# Altium schematic sheet Outputs.SchDoc
size A2
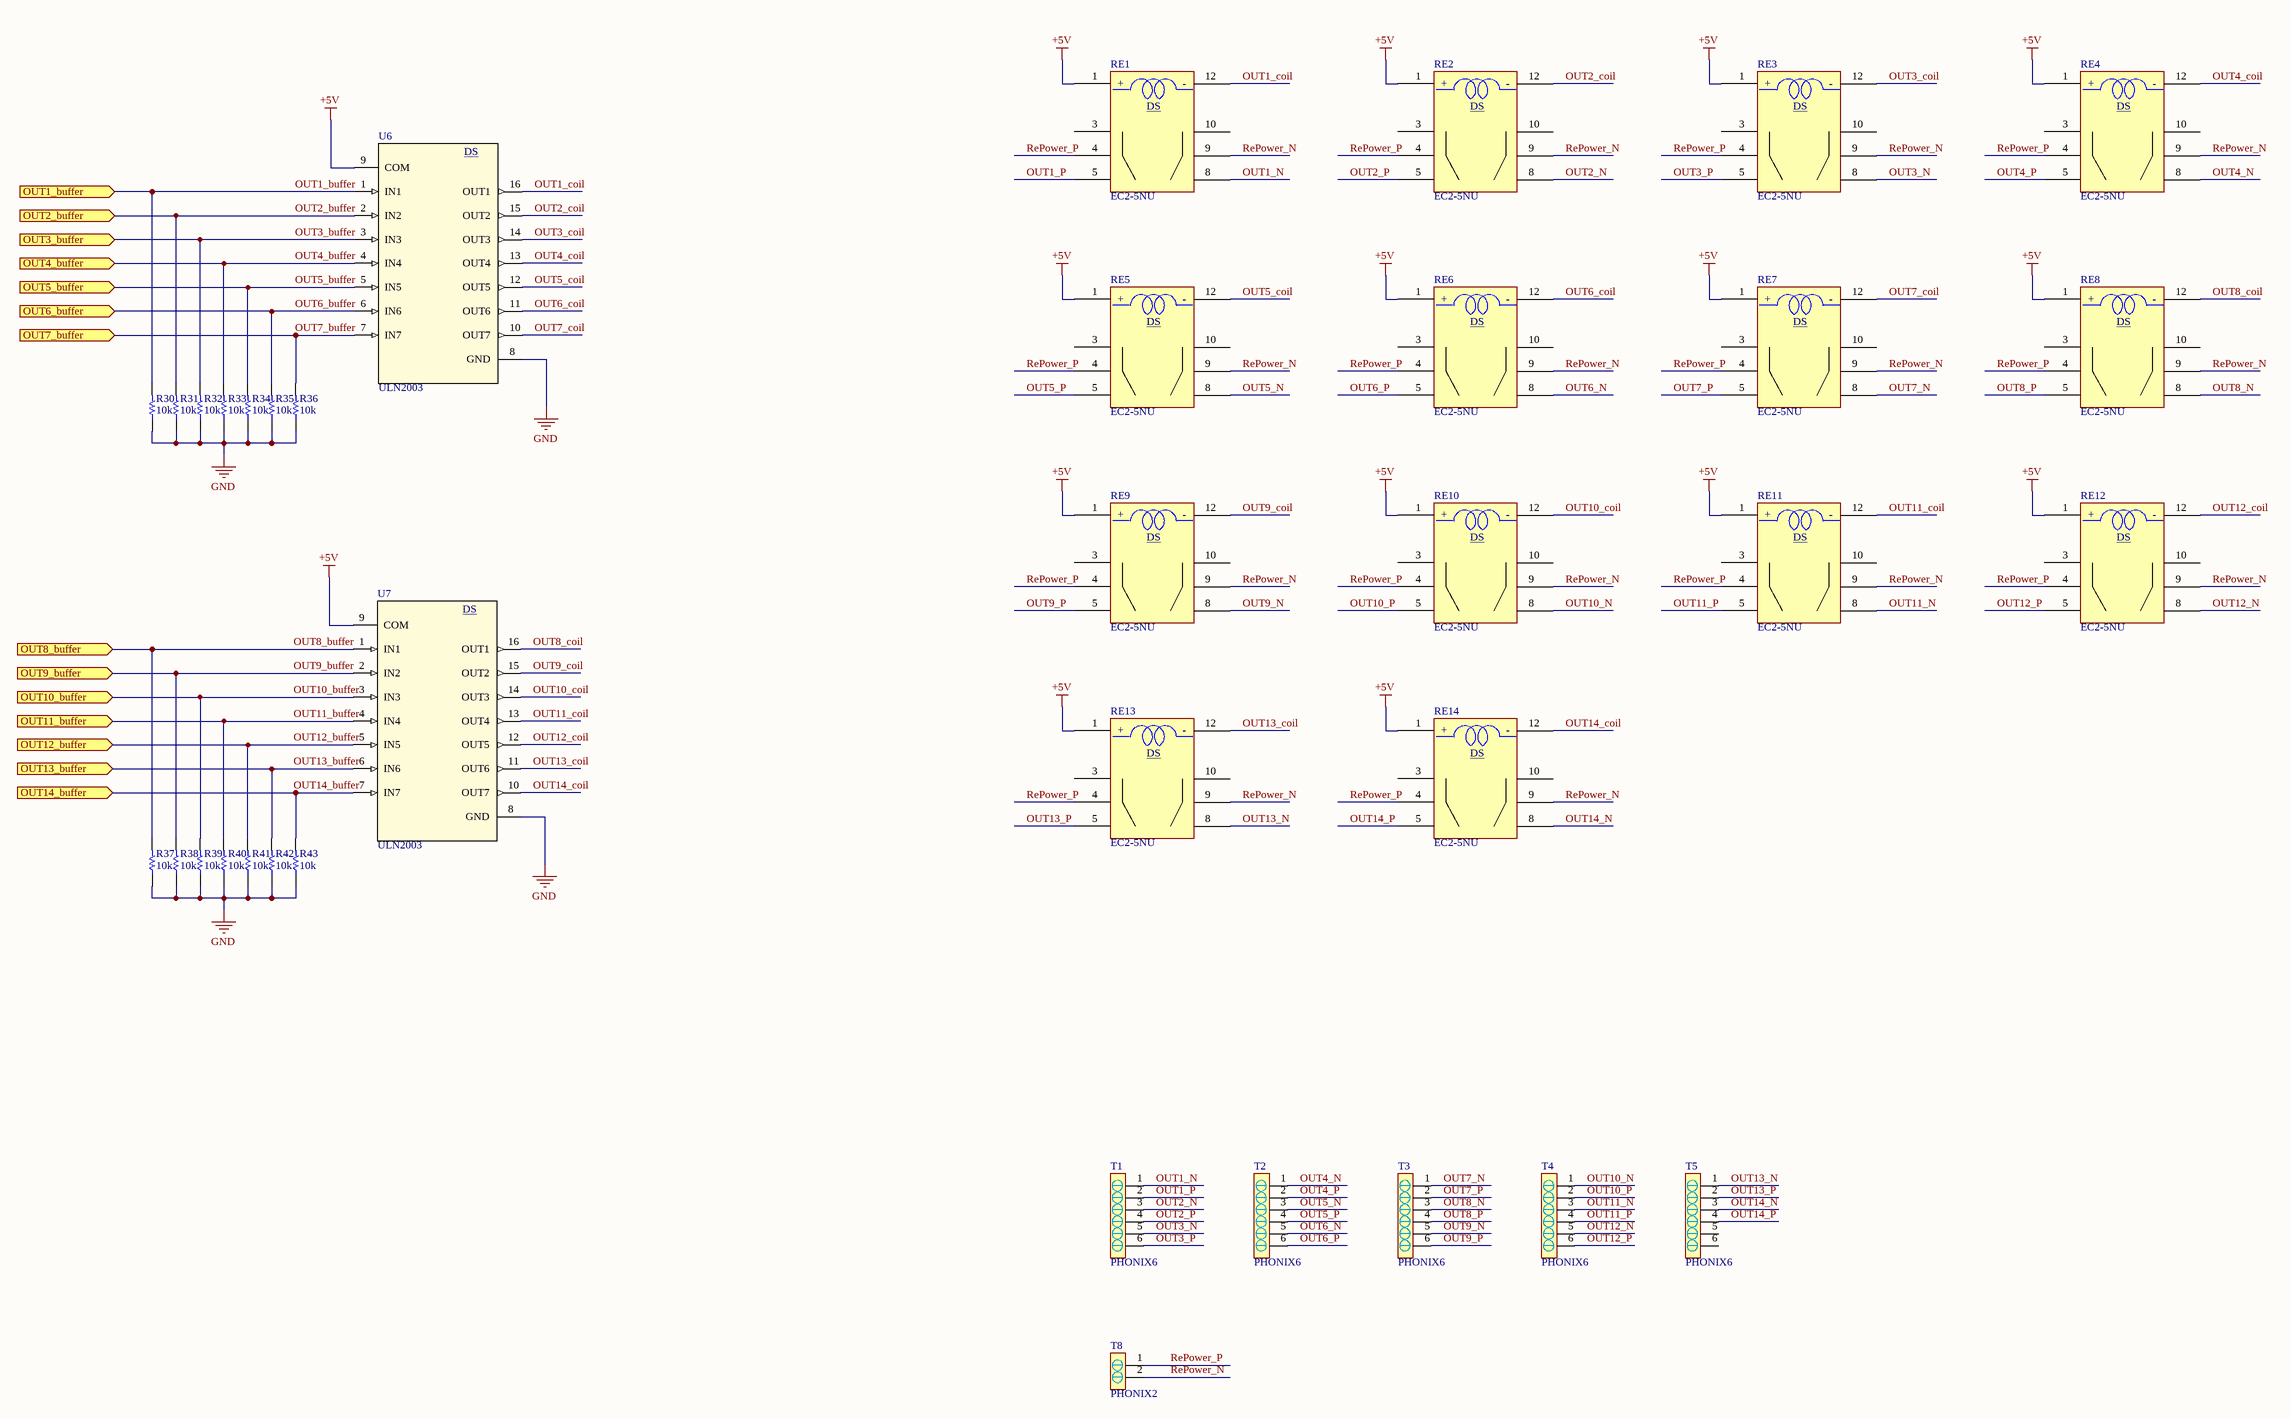
[diagram p0: Outputs.SchDoc]

## Parts
R30  value 10k  [R-805]  (hidden comment: R-805)
R31  value 10k  [R-805]  (hidden comment: R-805)
R32  value 10k  [R-805]  (hidden comment: R-805)
R33  value 10k  [R-805]  (hidden comment: R-805)
R34  value 10k  [R-805]  (hidden comment: R-805)
R35  value 10k  [R-805]  (hidden comment: R-805)
R36  value 10k  [R-805]  (hidden comment: R-805)
R37  value 10k  [R-805]  (hidden comment: R-805)
R38  value 10k  [R-805]  (hidden comment: R-805)
R39  value 10k  [R-805]  (hidden comment: R-805)
R40  value 10k  [R-805]  (hidden comment: R-805)
R41  value 10k  [R-805]  (hidden comment: R-805)
R42  value 10k  [R-805]  (hidden comment: R-805)
R43  value 10k  [R-805]  (hidden comment: R-805)
RE1  EC2-5NU  [EC2-5NU]
RE2  EC2-5NU  [EC2-5NU]
RE3  EC2-5NU  [EC2-5NU]
RE4  EC2-5NU  [EC2-5NU]
RE5  EC2-5NU  [EC2-5NU]
RE6  EC2-5NU  [EC2-5NU]
RE7  EC2-5NU  [EC2-5NU]
RE8  EC2-5NU  [EC2-5NU]
RE9  EC2-5NU  [EC2-5NU]
RE10  EC2-5NU  [EC2-5NU]
RE11  EC2-5NU  [EC2-5NU]
RE12  EC2-5NU  [EC2-5NU]
RE13  EC2-5NU  [EC2-5NU]
RE14  EC2-5NU  [EC2-5NU]
T1  PHONIX6  [PHONIX6]
T2  PHONIX6  [PHONIX6]
T3  PHONIX6  [PHONIX6]
T4  PHONIX6  [PHONIX6]
T5  PHONIX6  [PHONIX6]
T8  PHONIX2  [PHONIX2]
U6  ULN2003  [ULN20003]
U7  ULN2003  [ULN20003]

## Ports
OUT1_buffer (in), OUT2_buffer (in), OUT3_buffer (in), OUT4_buffer (in), OUT5_buffer (in), OUT6_buffer (in), OUT7_buffer (in), OUT8_buffer (in), OUT9_buffer (in), OUT10_buffer (in), OUT11_buffer (in), OUT12_buffer (in), OUT13_buffer (in), OUT14_buffer (in)

## Nets
+5V: RE1.1 RE2.1 RE3.1 RE4.1 RE5.1 RE6.1 RE7.1 RE8.1 RE9.1 RE10.1 RE11.1 RE12.1 RE13.1 RE14.1 U6.9(COM) U7.9(COM)
GND: R30.1 R31.1 R32.1 R33.1 R34.1 R35.1 R36.1 R37.1 R38.1 R39.1 R40.1 R41.1 R42.1 R43.1 U6.8(GND) U7.8(GND)
OUT1_buffer: R30.2 U6.1(IN1) ; port OUT1_buffer
OUT1_coil: RE1.12 U6.16(OUT1)
OUT1_N: RE1.8 T1.1
OUT1_P: RE1.5 T1.2
OUT2_buffer: R31.2 U6.2(IN2) ; port OUT2_buffer
OUT2_coil: RE2.12 U6.15(OUT2)
OUT2_N: RE2.8 T1.3
OUT2_P: RE2.5 T1.4
OUT3_buffer: R32.2 U6.3(IN3) ; port OUT3_buffer
OUT3_coil: RE3.12 U6.14(OUT3)
OUT3_N: RE3.8 T1.5
OUT3_P: RE3.5 T1.6
OUT4_buffer: R33.2 U6.4(IN4) ; port OUT4_buffer
OUT4_coil: RE4.12 U6.13(OUT4)
OUT4_N: RE4.8 T2.1
OUT4_P: RE4.5 T2.2
OUT5_buffer: R34.2 U6.5(IN5) ; port OUT5_buffer
OUT5_coil: RE5.12 U6.12(OUT5)
OUT5_N: RE5.8 T2.3
OUT5_P: RE5.5 T2.4
OUT6_buffer: R35.2 U6.6(IN6) ; port OUT6_buffer
OUT6_coil: RE6.12 U6.11(OUT6)
OUT6_N: RE6.8 T2.5
OUT6_P: RE6.5 T2.6
OUT7_buffer: R36.2 U6.7(IN7) ; port OUT7_buffer
OUT7_coil: RE7.12 U6.10(OUT7)
OUT7_N: RE7.8 T3.1
OUT7_P: RE7.5 T3.2
OUT8_buffer: R37.2 U7.1(IN1) ; port OUT8_buffer
OUT8_coil: RE8.12 U7.16(OUT1)
OUT8_N: RE8.8 T3.3
OUT8_P: RE8.5 T3.4
OUT9_buffer: R38.2 U7.2(IN2) ; port OUT9_buffer
OUT9_coil: RE9.12 U7.15(OUT2)
OUT9_N: RE9.8 T3.5
OUT9_P: RE9.5 T3.6
OUT10_buffer: R39.2 U7.3(IN3) ; port OUT10_buffer
OUT10_coil: RE10.12 U7.14(OUT3)
OUT10_N: RE10.8 T4.1
OUT10_P: RE10.5 T4.2
OUT11_buffer: R40.2 U7.4(IN4) ; port OUT11_buffer
OUT11_coil: RE11.12 U7.13(OUT4)
OUT11_N: RE11.8 T4.3
OUT11_P: RE11.5 T4.4
OUT12_buffer: R41.2 U7.5(IN5) ; port OUT12_buffer
OUT12_coil: RE12.12 U7.12(OUT5)
OUT12_N: RE12.8 T4.5
OUT12_P: RE12.5 T4.6
OUT13_buffer: R42.2 U7.6(IN6) ; port OUT13_buffer
OUT13_coil: RE13.12 U7.11(OUT6)
OUT13_N: RE13.8 T5.1
OUT13_P: RE13.5 T5.2
OUT14_buffer: R43.2 U7.7(IN7) ; port OUT14_buffer
OUT14_coil: RE14.12 U7.10(OUT7)
OUT14_N: RE14.8 T5.3
OUT14_P: RE14.5 T5.4
RePower_N: RE1.9 RE2.9 RE3.9 RE4.9 RE5.9 RE6.9 RE7.9 RE8.9 RE9.9 RE10.9 RE11.9 RE12.9 RE13.9 RE14.9 T8.2
RePower_P: RE1.4 RE2.4 RE3.4 RE4.4 RE5.4 RE6.4 RE7.4 RE8.4 RE9.4 RE10.4 RE11.4 RE12.4 RE13.4 RE14.4 T8.1

Not connected (* = marked no-connect by the designer): RE1 3 10; RE2 3 10; RE3 3 10; RE4 3 10; RE5 3 10; RE6 3 10; RE7 3 10; RE8 3 10; RE9 3 10; RE10 3 10; RE11 3 10; RE12 3 10; RE13 3 10; RE14 3 10; T5 5 6

## Notes on the sheet
- (in symbol EC2_5NU) +; -; DS
- (in symbol ULN2003) DS

## Library data of the parts
R30-R43 = R-805: Resistor
RE1-RE14 = EC2_5NU
U6 U7 = ULN2003: No Description Available; PartNumber: ULN2003ADR; Manufacturer: Texas Instruments; RefDes: RefDes; Type: DEV; Value: Value; Copyright: Copyright (C) 2018 Accelerated Designs. All rights reserved